# EasyEDA schematic SCH_595级联模块_2023-01-18.json
TITLE: Sheet_1; REV: 1.0; Date: 2022-11-29; Sheet: 1/1; Drawn By: BDJZ; Company: Your Company
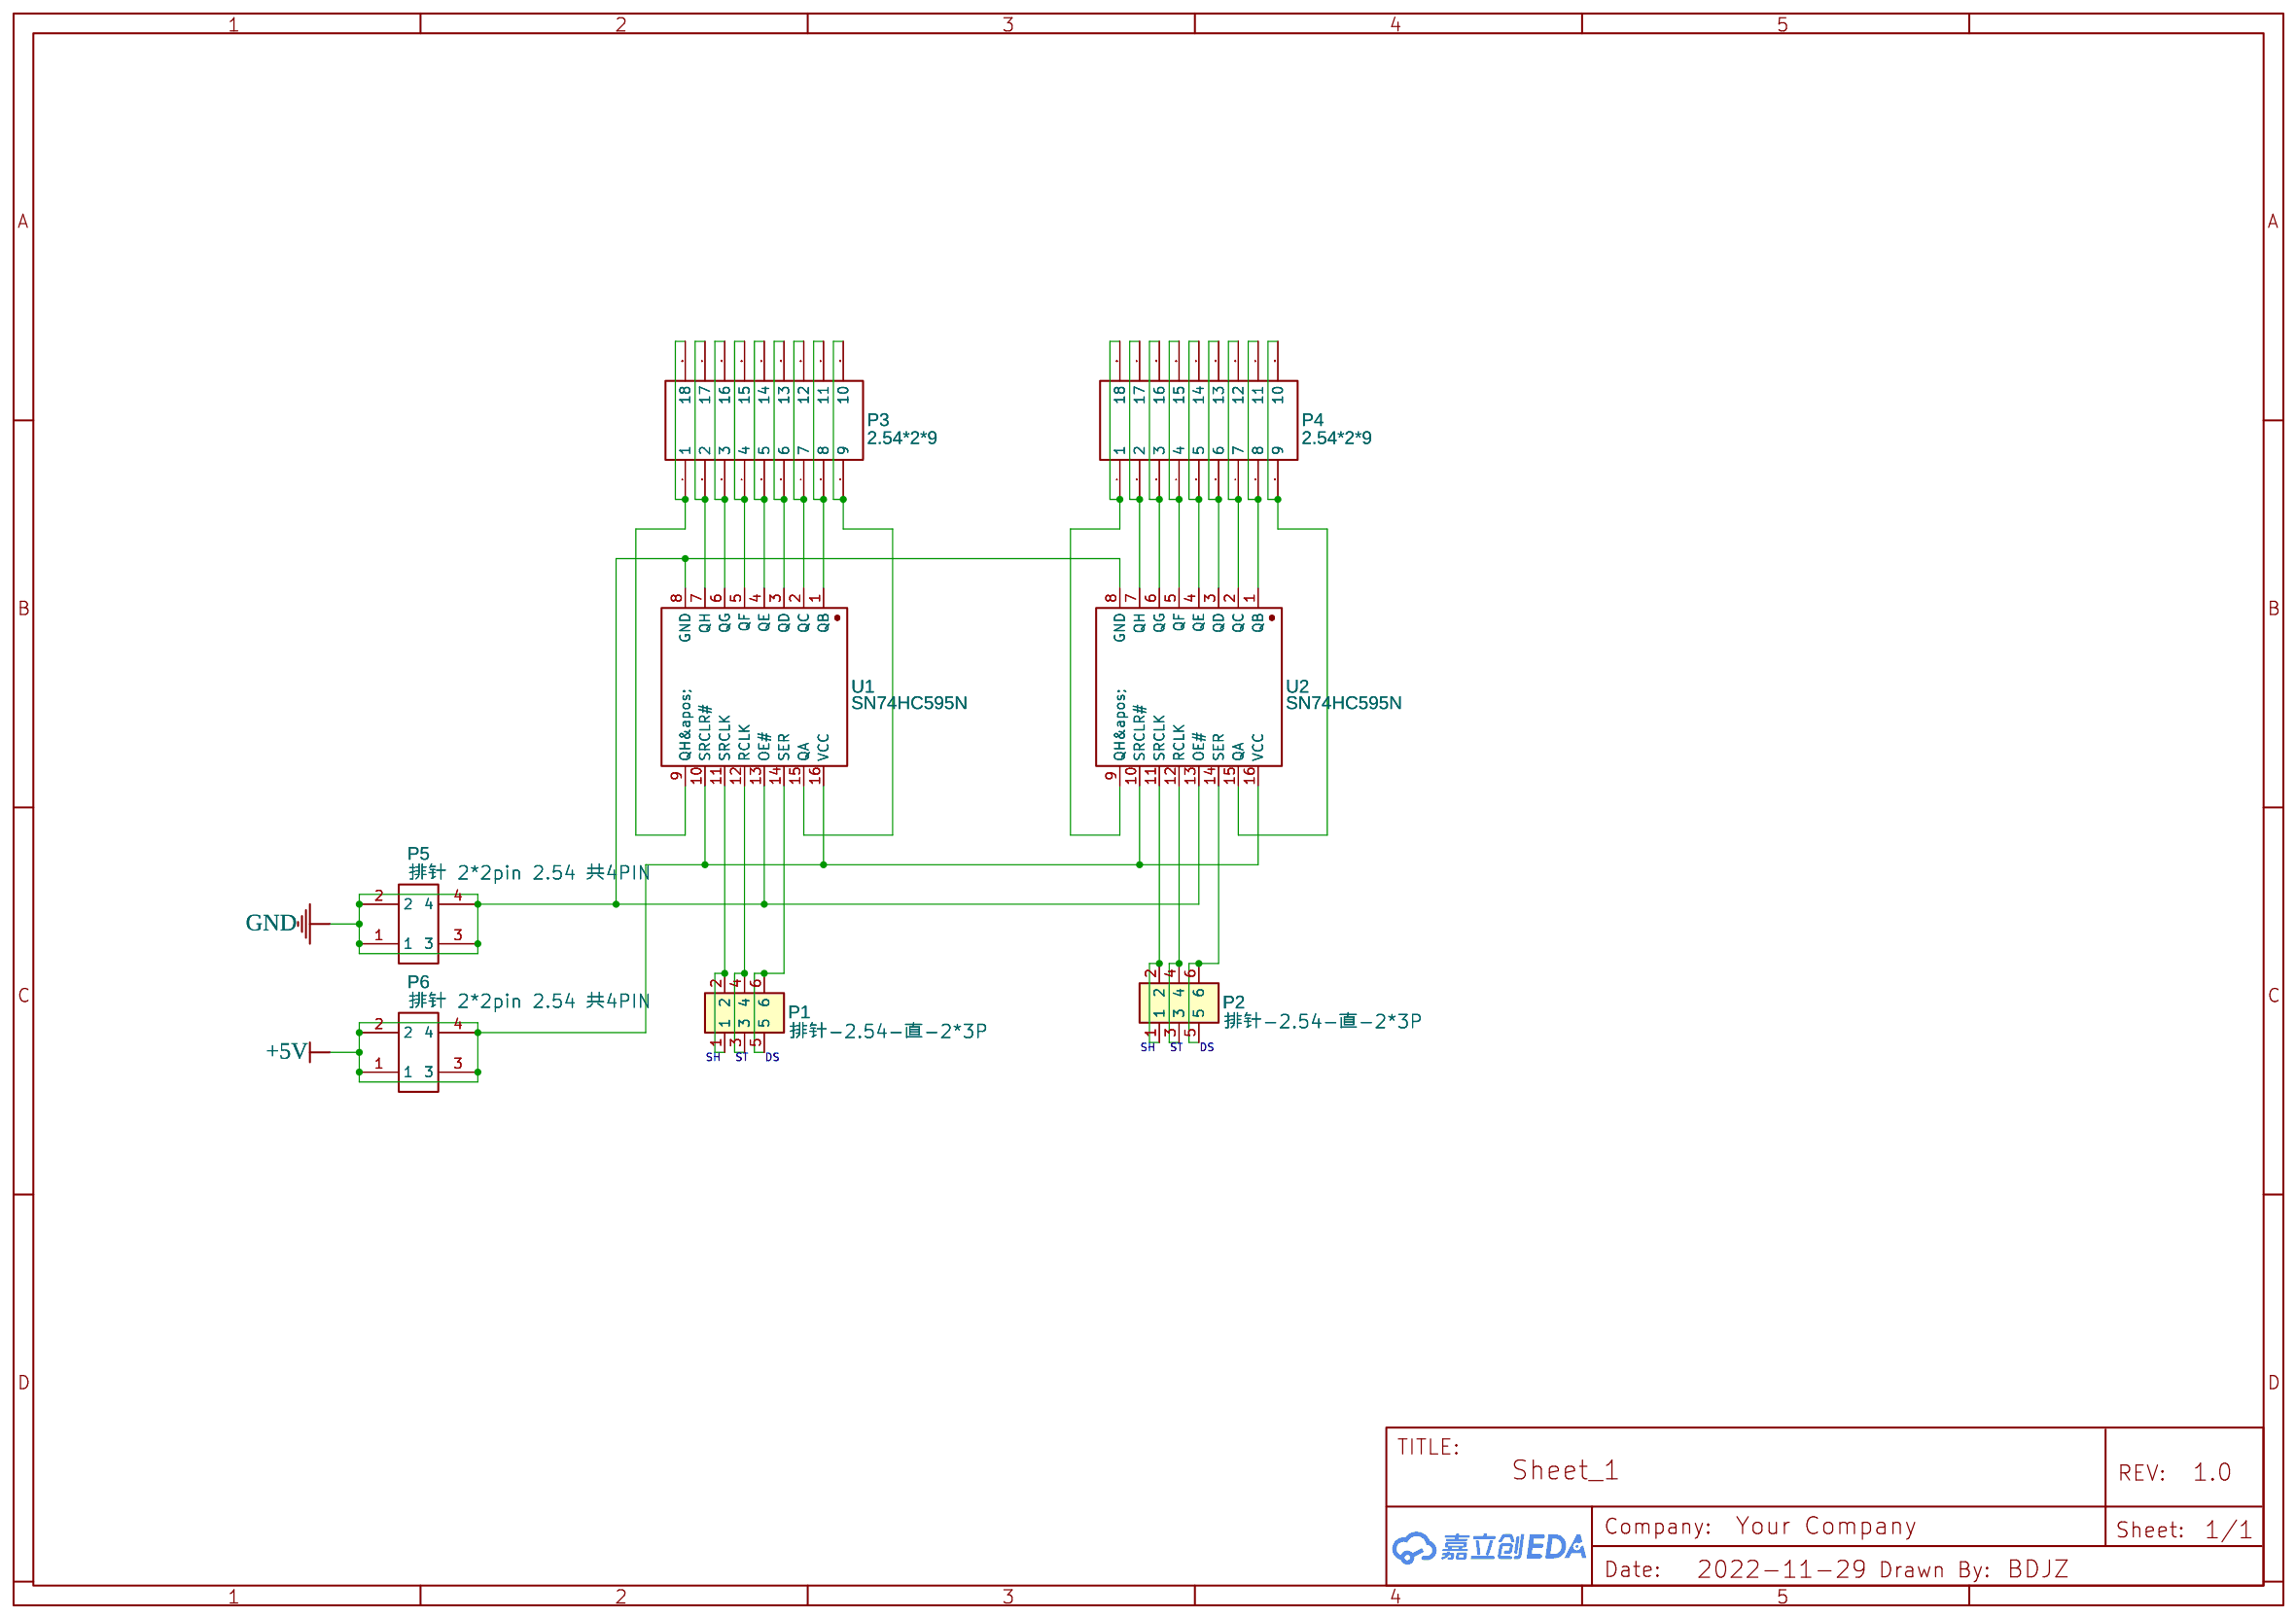
[diagram p0: schematic sheet]

## Parts
P1  排针-2.54-直-2*3P  [排针-2.54-直-2*3P]
P2  排针-2.54-直-2*3P  [排针-2.54-直-2*3P]
P3  2.54*2*9  [2.54-2*9P_TIGHT_JX]
P4  2.54*2*9  [2.54-2*9P_TIGHT_JX]
P5  排针 2*2pin 2.54 共4PIN  [2*2P 2.54]
P6  排针 2*2pin 2.54 共4PIN  [2*2P 2.54]
U1  SN74HC595N  [DIP-16_L19.8-W6.5-P2.54-LS7.6-BL]
U2  SN74HC595N  [DIP-16_L19.8-W6.5-P2.54-LS7.6-BL]

## Library data of the parts
P1 P2 = 排针-2.54-直-2*3P: Contributor: fajunli
P3 P4 = 2.54*2*9: Supplier Part: C115247; Supplier: LCSC; Contributor: lixiaoye
P5 P6 = 排针 2*2pin 2.54 共4PIN: Contributor: LYMarvin
U1 U2 = SN74HC595N: Supplier: LCSC; Manufacturer: TI(德州仪器); Supplier Part: C78711; JLCPCB Part Class: Extended Part

## Nets
+5V: P6.1 P6.2 P6.3 P6.4 U1.10(SRCLR#) U1.16(VCC) U2.10(SRCLR#) U2.16(VCC)
GND: P5.1 P5.2 P5.3 P5.4 U1.8(GND) U1.13(OE#) U2.8(GND) U2.13(OE#)
Net-(P1-1): P1.1 P1.2 U1.11(SRCLK)
Net-(P1-3): P1.3 P1.4 U1.12(RCLK)
Net-(P1-5): P1.5 P1.6 U1.14(SER)
Net-(P2-1): P2.1 P2.2 U2.11(SRCLK)
Net-(P2-3): P2.3 P2.4 U2.12(RCLK)
Net-(P2-5): P2.5 P2.6 U2.14(SER)
Net-(P3-1): P3.1 P3.18 U1.9(QH')
Net-(P3-2): P3.2 P3.17 U1.7(QH)
Net-(P3-3): P3.3 P3.16 U1.6(QG)
Net-(P3-4): P3.4 P3.15 U1.5(QF)
Net-(P3-5): P3.5 P3.14 U1.4(QE)
Net-(P3-6): P3.6 P3.13 U1.3(QD)
Net-(P3-7): P3.7 P3.12 U1.2(QC)
Net-(P3-8): P3.8 P3.11 U1.1(QB)
Net-(P3-9): P3.9 P3.10 U1.15(QA)
Net-(P4-1): P4.1 P4.18 U2.9(QH')
Net-(P4-2): P4.2 P4.17 U2.7(QH)
Net-(P4-3): P4.3 P4.16 U2.6(QG)
Net-(P4-4): P4.4 P4.15 U2.5(QF)
Net-(P4-5): P4.5 P4.14 U2.4(QE)
Net-(P4-6): P4.6 P4.13 U2.3(QD)
Net-(P4-7): P4.7 P4.12 U2.2(QC)
Net-(P4-8): P4.8 P4.11 U2.1(QB)
Net-(P4-9): P4.9 P4.10 U2.15(QA)

## Notes on the sheet
- SH
- ST
- DS
- SH
- ST
- DS
